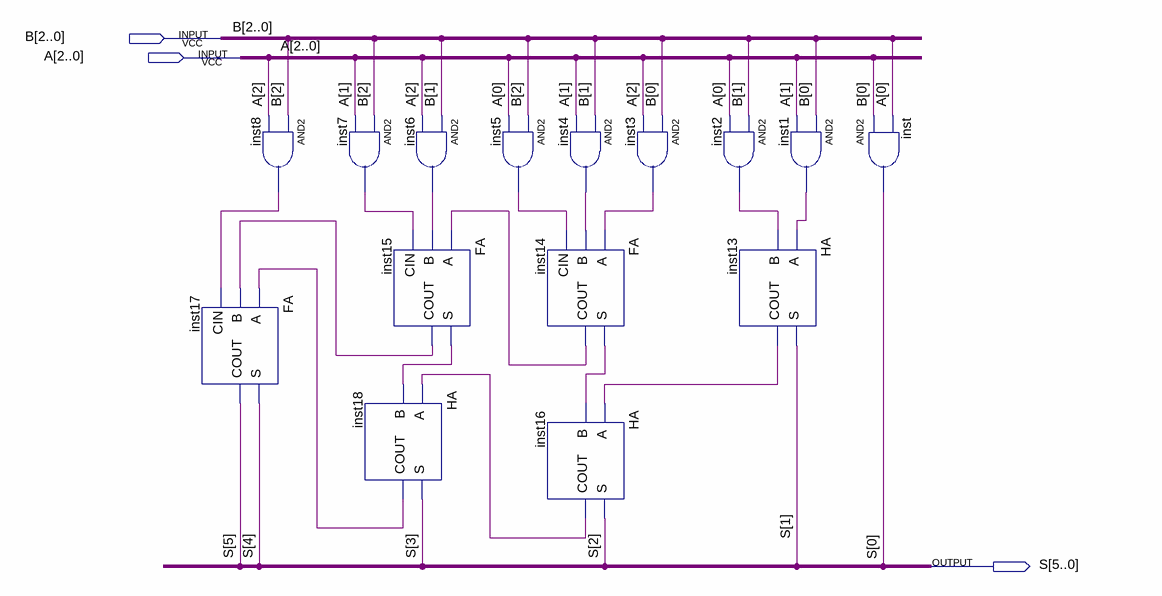
[diagram p0: schematic sheet]
// Quartus schematic nhan4bit.bdf as structural Verilog: 15 symbols, 3 pins
module nhan4bit (
  input  [2:0] B,
  input  [2:0] A,
  output [5:0] S
);

  wire inst1_out, inst2_out, inst3_out, inst4_out, inst5_out, inst6_out, inst7_out, inst8_out, inst13_cout,
       inst14_cout, inst14_s, inst15_cout, inst15_s, inst16_cout, inst18_cout;

  FA inst17 (.A(inst18_cout), .B(inst15_cout), .CIN(inst8_out), .S(S[4]), .COUT(S[5]));
  and inst8 (inst8_out, B[2], A[2]);
  and inst7 (inst7_out, B[2], A[1]);
  FA inst15 (.A(inst14_cout), .B(inst6_out), .CIN(inst7_out), .S(inst15_s), .COUT(inst15_cout));
  HA inst18 (.A(inst16_cout), .B(inst15_s), .S(S[3]), .COUT(inst18_cout));
  and inst6 (inst6_out, B[1], A[2]);
  and inst5 (inst5_out, B[2], A[0]);
  FA inst14 (.A(inst3_out), .B(inst4_out), .CIN(inst5_out), .S(inst14_s), .COUT(inst14_cout));
  HA inst16 (.A(inst13_cout), .B(inst14_s), .S(S[2]), .COUT(inst16_cout));
  and inst4 (inst4_out, B[1], A[1]);
  and inst3 (inst3_out, B[0], A[2]);
  and inst2 (inst2_out, B[1], A[0]);
  HA inst13 (.A(inst1_out), .B(inst2_out), .S(S[1]), .COUT(inst13_cout));
  and inst1 (inst1_out, B[0], A[1]);
  and inst (S[0], B[0], A[0]);
endmodule
